# Altium schematic sheet 2020年电赛校赛功率板.SchDoc
size A4
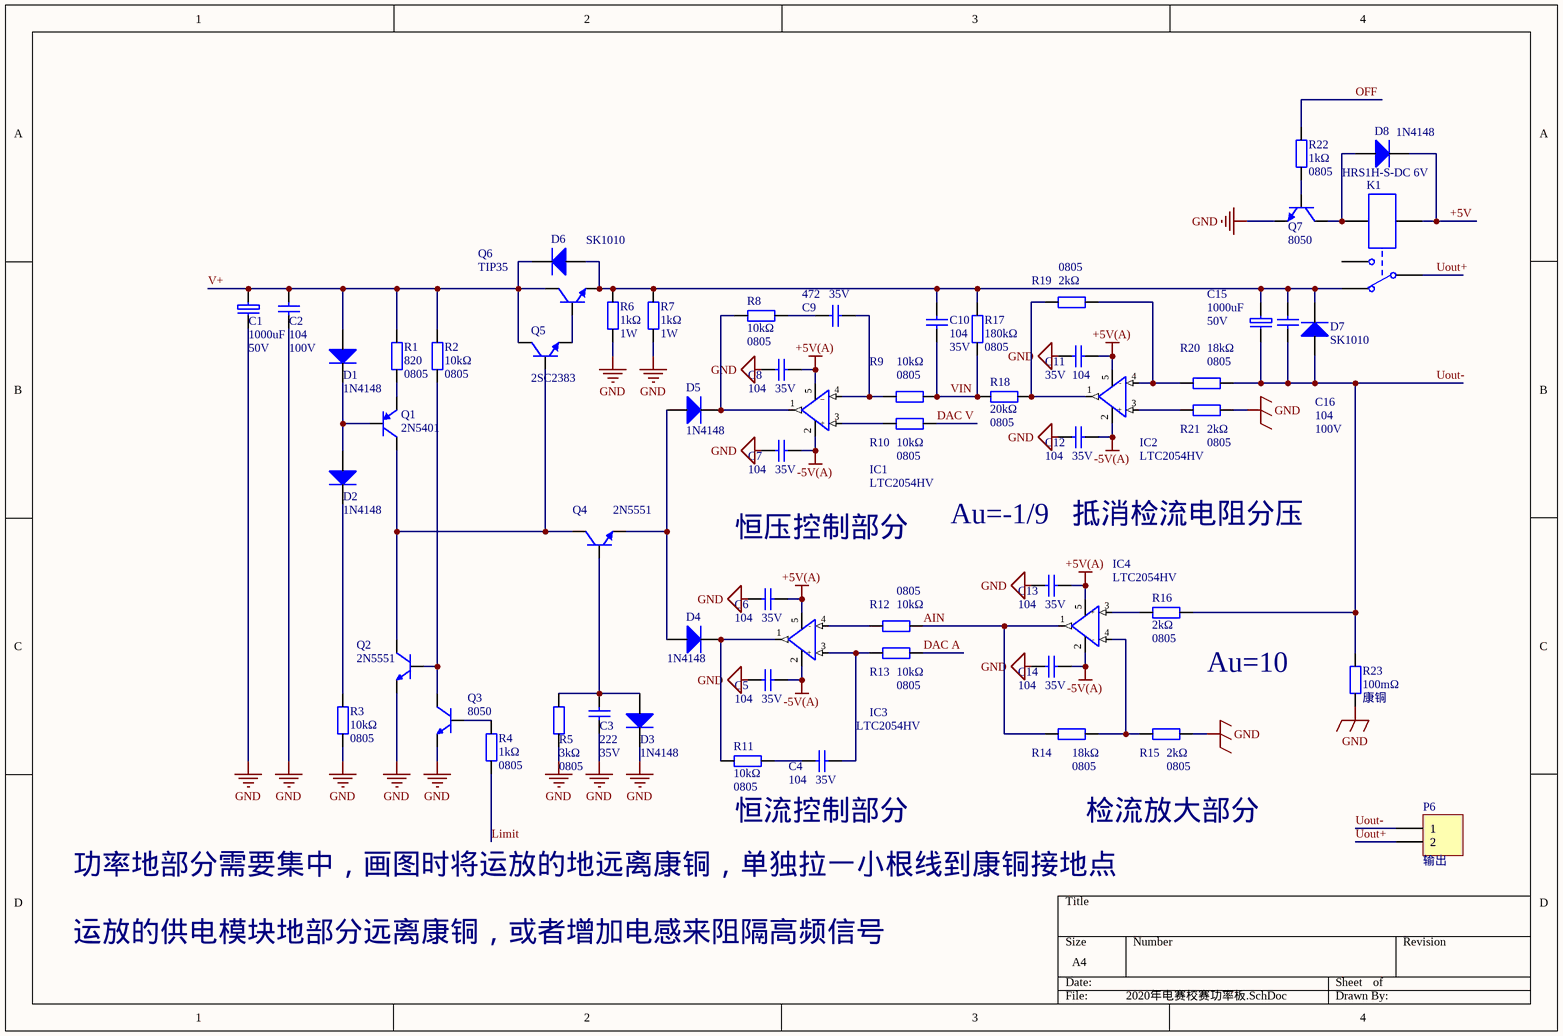
[diagram p0: 2020年电赛校赛功率板.SchDoc]

## Parts
C1  1000uF  value 50V  [CR132(Φ13.2,间距5.1)]
C2  104  value 100V  [C0805]
C3  222  value 35V  [C0805]
C4  104  value 35V  [C0805]
C5  104  value 35V  [C0805]
C6  104  value 35V  [C0805]
C7  104  value 35V  [C0805]
C8  104  value 35V  [C0805]
C9  472  value 35V  [C0805]
C10  104  value 35V  [C0805]
C11  104  value 35V  [C0805]
C12  104  value 35V  [C0805]
C13  104  value 35V  [C0805]
C14  104  value 35V  [C0805]
C15  1000uF  value 50V  [CR132(Φ13.2,间距5.1)]
C16  104  value 100V  [C0805]
D1  1N4148  [LL34]
D2  1N4148  [LL34]
D3  1N4148  [LL34]
D4  1N4148  [LL34]
D5  1N4148  [LL34]
D6  SK1010  [SMC(DO-214AB)]
D7  SK1010  [SMC(DO-214AB)]
D8  1N4148  [LL34]
IC1  LTC2054HV  [TSOT-32-5]
IC2  LTC2054HV  [TSOT-32-5]
IC3  LTC2054HV  [TSOT-32-5]
IC4  LTC2054HV  [TSOT-32-5]
K1  HRS1H-S-DC 6V  [继电器]
P6  输出  [KF7.62-2P]
Q1  2N5401  [SOT-23]
Q2  2N5551  [SOT-23]
Q3  8050  [SOT-23]
Q4  2N5551  [SOT-23]
Q5  2SC2383  [TO-92]
Q6  TIP35  [TO-247]
Q7  8050  [SOT-23]
R1  820  value 0805  [R0805]
R2  10kΩ  value 0805  [R0805]
R3  10kΩ  value 0805  [R0805]
R4  1kΩ  value 0805  [R0805]
R5  3kΩ  value 0805  [R0805]
R6  1kΩ  value 1W  [RES-1W(立式)]
R7  1kΩ  value 1W  [RES-1W(立式)]
R8  10kΩ  value 0805  [R0805]
R9  10kΩ  value 0805  [R0805]
R10  10kΩ  value 0805  [R0805]
R11  10kΩ  value 0805  [R0805]
R12  10kΩ  value 0805  [R0805]
R13  10kΩ  value 0805  [R0805]
R14  18kΩ  value 0805  [R0805]
R15  2kΩ  value 0805  [R0805]
R16  2kΩ  value 0805  [R0805]
R17  180kΩ  value 0805  [R0805]
R18  20kΩ  value 0805  [R0805]
R19  2kΩ  value 0805  [R0805]
R20  18kΩ  value 0805  [R0805]
R21  2kΩ  value 0805  [R0805]
R22  1kΩ  value 0805  [R0805]
R23  100mΩ  value 康铜  [100mΩ康铜]

## Nets
+5V(A): C6.2 C8.2 C11.2 C13.2 IC1.5 IC2.5 IC3.5 IC4.5
-5V(A): C5.2 C7.2 C12.2 C14.2 IC1.2 IC2.2 IC3.2 IC4.2
GND: C1.2(-) C2.1 C3.1 C5.1 C6.1 C7.1 C8.1 C11.1 C12.1 C13.1 C14.1 D3.2(K) Q2.3(E) Q3.3(E) Q7.3(E) R3.1 R5.1 R6.1 R7.1 R15.1 R21.1 R23.2
+5V: D8.2(K) K1.2
AIN: IC4.1 R12.2 R14.2
DAC A: R13.2
DAC V: R10.2
Limit: R4.1
OFF: R22.2
Uout+: K1.4 P6.2
Uout-: C15.2(-) C16.1 D7.1(A) P6.1 R16.1 R20.1 R23.1
V+: C1.1(+) C2.2 D1.1(A) D6.2(K) Q5.2(C) Q6.2(C) R1.2 R2.2
VIN: C10.1 R9.2 R17.1 R18.1
NetC3_2: C3.2 D3.1(A) Q4.1(B) R5.2
NetC4_1: C4.1 R11.2
NetC4_2: C4.2 IC3.3(+) R13.1
NetC9_1: C9.1 R8.2
NetC9_2: C9.2 IC1.4(_) R9.1
NetC10_2: C10.2 C15.1(+) C16.2 D6.1(A) D7.2(K) K1.1 Q6.3(E) R6.2 R7.2 R17.2
NetD1_2: D1.2(K) D2.1(A) Q1.1(B)
NetD2_2: D2.2(K) R3.2
NetD4_1: D4.1(A) D5.1(A) Q4.3(E)
NetD4_2: D4.2(K) IC3.1 R11.1
NetD5_2: D5.2(K) IC1.1 R8.1
NetD8_1: D8.1(A) K1.5 Q7.1(C)
NetIC1_3: IC1.3(+) R10.1
NetIC2_1: IC2.1 R18.2 R19.2
NetIC2_3: IC2.3(+) R21.2
NetIC2_4: IC2.4(-) R19.1 R20.2
NetIC3_4: IC3.4(-) R12.1
NetIC4_3: IC4.3(+) R16.2
NetIC4_4: IC4.4(-) R14.1 R15.2
NetQ1_2: Q1.2(C) Q2.2(C) Q4.2(C) Q5.3(B)
NetQ1_3: Q1.3(E) R1.1
NetQ2_1: Q2.1(B) Q3.2(C) R2.1
NetQ3_1: Q3.1(B) R4.2
NetQ5_1: Q5.1(E) Q6.1(B)
NetQ7_2: Q7.2(B) R22.1

Not connected (* = marked no-connect by the designer): K1 6

## Notes on the sheet
- 恒压控制部分
- Au=-1/9
- 抵消检流电阻分压
- Au=10
- 恒流控制部分
- 检流放大部分
- 功率地部分需要集中，画图时将运放的地远离康铜，单独拉一小根线到康铜接地点
- 运放的供电模块地部分远离康铜，或者增加电感来阻隔高频信号

## Library data of the parts
C1 C15 = 100uF: 有极性电容
C2-C14 C16 = 104: 无极性电容
D1-D8 = Diode: 二极管
IC1-IC4 = OPA350UA: 运放
K1 = HRS1H-S-DC 6V: 继电器
P6 = Header 2: Header, 2-Pin; LatestRevisionDate: 17-Jul-2002; LatestRevisionNote: Re-released for DXP Platform.; Publisher: Altium Limited
Q1 = PNP
Q2 = NPN!
Q3 = NPN!: 三极管
Q4-Q7 = NPN: 三极管
R1-R23 = 10kΩ: 贴片/直插电阻